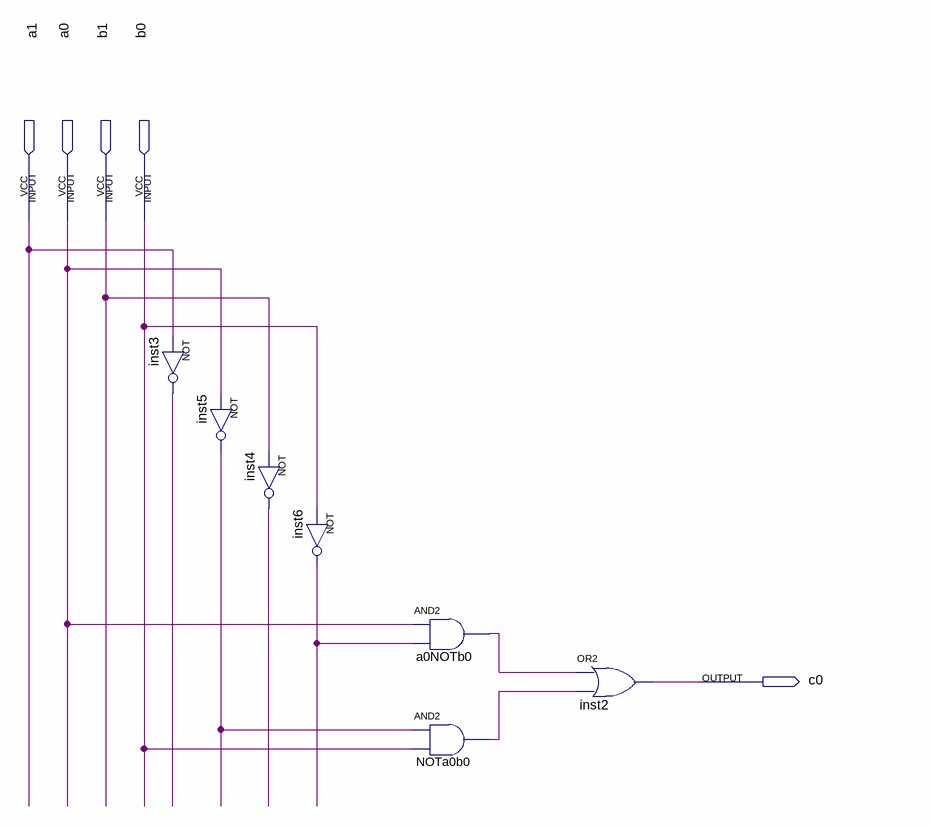
[diagram p0: schematic sheet]
// Quartus schematic c0Block.bdf as structural Verilog: 7 symbols, 5 pins
module c0Block (
  input  a1,
  input  a0,
  input  b1,
  input  b0,
  output c0
);

  wire a0NOTb0_out, inst3_out, inst4_out, inst5_out, inst6_out, NOTa0b0_out;

  not inst3 (inst3_out, a1);
  not inst5 (inst5_out, a0);
  not inst4 (inst4_out, b1);
  not inst6 (inst6_out, b0);
  and a0NOTb0 (a0NOTb0_out, a0, inst6_out);
  and NOTa0b0 (NOTa0b0_out, inst5_out, b0);
  or inst2 (c0, a0NOTb0_out, NOTa0b0_out);
endmodule
